# Altium schematic sheet microcontroller.SchDoc
size 297 x 209 mm; DrawnBy: Supun; Engineer: Supun; Organization: C3
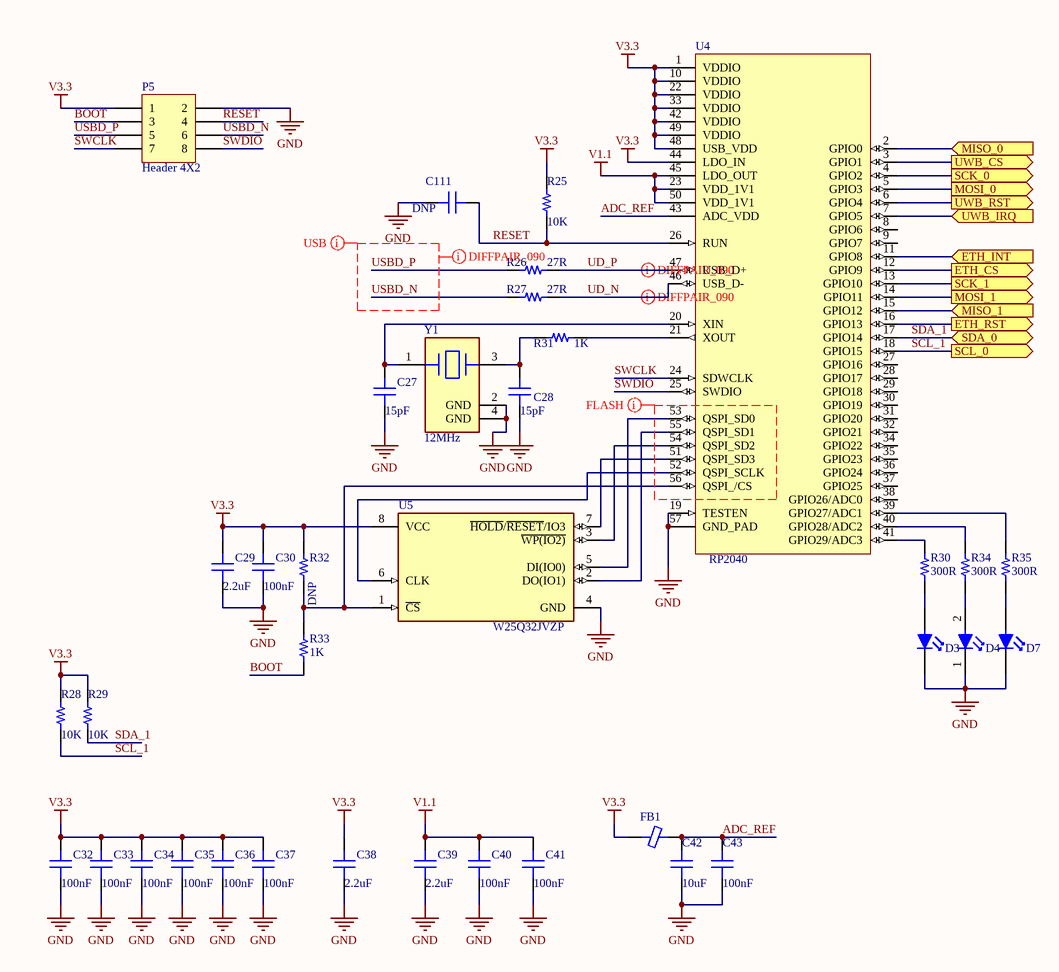
[diagram p0: microcontroller.SchDoc]

## Parts
C27  15pF  [CAP 0603_1608]
C28  15pF  [CAP 0603_1608]
C29  2.2uF  [CAP 0603_1608]
C30  100nF  [CAP 0603_1608]
C32  100nF  [CAP 0603_1608]
C33  100nF  [CAP 0603_1608]
C34  100nF  [CAP 0603_1608]
C35  100nF  [CAP 0603_1608]
C36  100nF  [CAP 0603_1608]
C37  100nF  [CAP 0603_1608]
C38  2.2uF  [CAP 0603_1608]
C39  2.2uF  [CAP 0603_1608]
C40  100nF  [CAP 0603_1608]
C41  100nF  [CAP 0603_1608]
C42  10uF  [CAP 0603_1608]
C43  100nF  [CAP 0603_1608]
C111  DNP  [CAP 0603_1608]
D3  Green  [Würth_Elektronik_0_MFG]  (value not drawn)
D4  Red  [Würth_Elektronik_0_MFG]  (value not drawn)
D7  Green  [Würth_Elektronik_0_MFG]  (value not drawn)
FB1  Ferrite Beads  [Murata_BLM18-0_15-t0_8_MFG]  (value not drawn)
P5  Header 4X2  [HDR2X4]
R25  10K  [RES 0603_1608]
R26  27R  [RES 0603_1608]
R27  27R  [RES 0603_1608]
R28  10K  [RES 0603_1608]
R29  10K  [RES 0603_1608]
R30  300R  [RES 0603_1608]
R31  1K  [RES 0603_1608]
R32  DNP  [RES 0603_1608]
R33  1K  [RES 0603_1608]
R34  300R  [RES 0603_1608]
R35  300R  [RES 0603_1608]
U4  RP2040  [RP2040-Footprint-1]
U5  W25Q32JVZP  [WINBOND WSON-8 6x5mm]
Y1  12MHz  [ABRACON ABM8G]

## Ports
ETH_CS (out), ETH_INT (in), ETH_RST (out), MISO_0 (in), MISO_1 (in), MOSI_0 (out), MOSI_1 (out), SCK_0 (out), SCK_1 (out), SCL_0 (out), SDA_0 (bidir), UWB_CS (out), UWB_IRQ (in), UWB_RST (out)

## Nets
GND: C27.1 C28.1 C29.2 C30.2 C32.2 C33.2 C34.2 C35.2 C36.2 C37.2 C38.2 C39.2 C40.2 C41.2 C42.2 C43.2 C111.1 D3.1(C) D4.1(C) D7.1(C) P5.2 U4.19(TESTEN) U4.57(GND_PAD) U5.4(GND) Y1.2(GND) Y1.4(GND)
V1.1: C39.1 C40.1 C41.1 U4.23(VDD_1V1) U4.45(LDO_OUT) U4.50(VDD_1V1)
V3.3: C29.1 C30.1 C32.1 C33.1 C34.1 C35.1 C36.1 C37.1 C38.1 FB1.1 P5.1 R25.2 R28.2 R29.2 R32.1 U4.1(VDDIO) U4.10(VDDIO) U4.22(VDDIO) U4.33(VDDIO) U4.42(VDDIO) U4.44(LDO_IN) U4.48(USB_VDD) U4.49(VDDIO) U5.8(VCC)
ADC_REF: C42.1 C43.1 FB1.2 U4.43(ADC_VDD)
BOOT: P5.3 R33.1
ETH_CS: U4.12(GPIO9) ; port ETH_CS
ETH_INT: U4.11(GPIO8) ; port ETH_INT
ETH_RST: U4.16(GPIO13) ; port ETH_RST
MISO_0: U4.2(GPIO0) ; port MISO_0
MISO_1: U4.15(GPIO12) ; port MISO_1
MOSI_0: U4.5(GPIO3) ; port MOSI_0
MOSI_1: U4.14(GPIO11) ; port MOSI_1
RESET: C111.2 P5.4 R25.1 U4.26(RUN)
SCK_0: U4.4(GPIO2) ; port SCK_0
SCK_1: U4.13(GPIO10) ; port SCK_1
SCL_1: R28.1 U4.18(GPIO15) ; port SCL_0
SDA_1: R29.1 U4.17(GPIO14) ; port SDA_0
SWCLK: P5.7 U4.24(SDWCLK)
SWDIO: P5.8 U4.25(SWDIO)
UD_N: R27.2 U4.46(USB_D-)
UD_P: R26.2 U4.47(USB_D+)
USBD_N: P5.6 R27.1
USBD_P: P5.5 R26.1
UWB_CS: U4.3(GPIO1) ; port UWB_CS
UWB_IRQ: U4.7(GPIO5) ; port UWB_IRQ
UWB_RST: U4.6(GPIO4) ; port UWB_RST
NetC27_2: C27.2 U4.20(XIN) Y1.1
NetC28_2: C28.2 R31.1 Y1.3
NetD3_2: D3.2(A) R30.2
NetD4_2: D4.2(A) R34.2
NetD7_2: D7.2(A) R35.1
NetR30_1: R30.1 U4.41(GPIO29/ADC3)
NetR31_2: R31.2 U4.21(XOUT)
NetR32_2: R32.2 R33.2 U4.56(QSPI_/CS) U5.1(~{CS})
NetR34_1: R34.1 U4.40(GPIO28/ADC2)
NetR35_2: R35.2 U4.39(GPIO27/ADC1)
NetU4_51: U4.51(QSPI_SD3) U5.7(~{HOLD}/~{RESET}/IO3)
NetU4_52: U4.52(QSPI_SCLK) U5.6(CLK)
NetU4_53: U4.53(QSPI_SD0) U5.5(DI(IO0))
NetU4_54: U4.54(QSPI_SD2) U5.3(~{WP(IO2)})
NetU4_55: U4.55(QSPI_SD1) U5.2(DO(IO1))

Not connected (* = marked no-connect by the designer): U4 8(GPIO6) 9(GPIO7) 27(GPIO16) 28(GPIO17) 29(GPIO18) 30(GPIO19) 31(GPIO20) 32(GPIO21) 34(GPIO22) 35(GPIO23) 36(GPIO24) 37(GPIO25) 38(GPIO26/ADC0)

## Layout directives
differential pair; differential pair class DIFF090: UD_N, UD_P, USBD_N, USBD_P
net class FLASH: (no net found under the mark)
net class USB: USBD_N, USBD_P

## Notes on the sheet
- Title
- Size:
- Date:
- A4
- Number:
- Time:
- Revision:
- Sheet
- of
- File:

## Library data of the parts
C27 C28 = Capacitor: SMT Capacitor; MF: Murata; MP: GRM1885C1H150JA01J; Value: 15pF; Link: https://www.mouser.com/ProductDetail/Murata-Electronics/GRM1885C1H150JA01J?qs=6X6%252BjuxzJaBd4%252Bvb3bD5Gw%3D%3D
C29 C38 C39 = Capacitor: SMT Capacitor; MF: Samsung; MP: CL10A225KP8NNNC; Value: 2.2uF; Link: https://www.mouser.com/ProductDetail/Samsung-Electro-Mechanics/CL10A225KP8NNNC?qs=hqM3L16%252Bxldb5UYUGQVB5Q%3D%3D
C30 C32-C37 C40 C41 C43 = Capacitor: SMT Capacitor; MF: TDK; MP: CGA3E2X7R1E104K080AA; Value: 100nF; Link: https://www.mouser.com/ProductDetail/TDK/CGA3E2X7R1E104K080AA?qs=NRhsANhppD%2Fm7%2FOmmsm0vg%3D%3D
C42 = Capacitor: SMT Capacitor; MF: Murata; MP: GRM188R61C106MAALD; Value: 10uF; Link: https://www.mouser.com/ProductDetail/Murata-Electronics/GRM188R61C106MAALD?qs=hNud%2FORuBR3LEOKZ4RJp9w%3D%3D
C111 = Capacitor: SMT Capacitor; MP: C0603C104K4PACTU; Value: DNP; Link: https://
D3 D7 = LED SMD: Led Diffused SMD; MF: LiteOn; MP: LTST-C190KGKT; Value: Green; Link: https://www.mouser.com/ProductDetail/Lite-On/LTST-C190KGKT?qs=205qCy6M2Q%252BAdcgwUZktqw%3D%3D
D4 = LED SMD: Led Diffused SMD; MF: LiteOn; MP: LTST-C190KRKT; Value: Red; Link: https://www.mouser.com/ProductDetail/Lite-On/LTST-C190KRKT?qs=kAD5fFa1n5VY3YYNWPC1Fg%3D%3D
FB1 = Ferrite Chip: SMT Ferrite Chip; MF: Murata; MP: BLM18PG471SN1D; Link: https://www.mouser.com/ProductDetail/Murata-Electronics/BLM18PG471SN1D?qs=EYzdjubb4S%2FN1Ip39GrHyg%3D%3D
P5 = Header 4X2: Header, 4-Pin, Dual row; LatestRevisionDate: 17-Jul-2002; LatestRevisionNote: Re-released for DXP Platform.; Publisher: Altium Limited
R25 R28 R29 = Resistor: SMT Resistor; MF: YAGEO; MP: AC0603FR-0710KL; Value: 10K; Link: https://www.mouser.com/ProductDetail/YAGEO/AC0603FR-0710KL?qs=UoPT7wUmgYKz3zh0UDMA4Q%3D%3D
R26 R27 = Resistor: SMT Resistor; MF: YAGEO; MP: AC0603FR-0727RL; Value: 27R; Link: https://www.mouser.com/ProductDetail/YAGEO/AC0603FR-0727RL?qs=yhV1fb9g%2FKZSwVP2Wqwqfg%3D%3D
R30 R34 R35 = Resistor: SMT Resistor; MF: YAGEO; MP: AC0603FR-07300RL; Value: 300R; Link: https://www.mouser.com/ProductDetail/YAGEO/AC0603FR-07300RL?qs=yhV1fb9g%2FKYRCKndxB9juA%3D%3D
R31 R33 = Resistor: SMT Resistor; MF: YAGEO; MP: AC0603FR-071KL; Value: 1K; Link: https://www.mouser.com/ProductDetail/YAGEO/AC0603FR-071KL?qs=UoPT7wUmgYJx4gI0q%252BcIRQ%3D%3D
R32 = Resistor: SMT Resistor; MF: *; MP: *; Value: DNP; Link: https://
U4 = RP2040: ARM® Cortex®-M0+ series Microcontroller IC 32-Bit Dual-Core 133MHz 16MB (16M x 8) FLASH 56-QFN (7x7); MF: Raspberry Pi; MP: RP2040TR13; Link: https://www.digikey.com/en/products/detail/raspberry-pi/SC0914-13/14306010
U5 = W25Q32JVZP: 3V 32M-BIT SERIAL FLASH MEMORY WITH DUAL, QUAD SPI; MF: Winbond; MP: W25Q32JVZPIQ; Value: *; Link: https://www.mouser.com/ProductDetail/Winbond/W25Q32JVZPIQ?qs=qSfuJ%252Bfl%2Fd5Ca0jgzBVqQA%3D%3D
Y1 = Crystal: Crystals AEC-Q200 CRYSTAL 4pin SMD; MF: ECS; MP: ECS-120-12-33-AGN-TR; Value: 12MHz; Link: https://www.mouser.com/ProductDetail/ECS/ECS-120-12-33-AGN-TR?qs=wd5RIQLrsJj7GY%252BaXCrd3A%3D%3D